# Altium project nixie-thermometer.PrjPcb
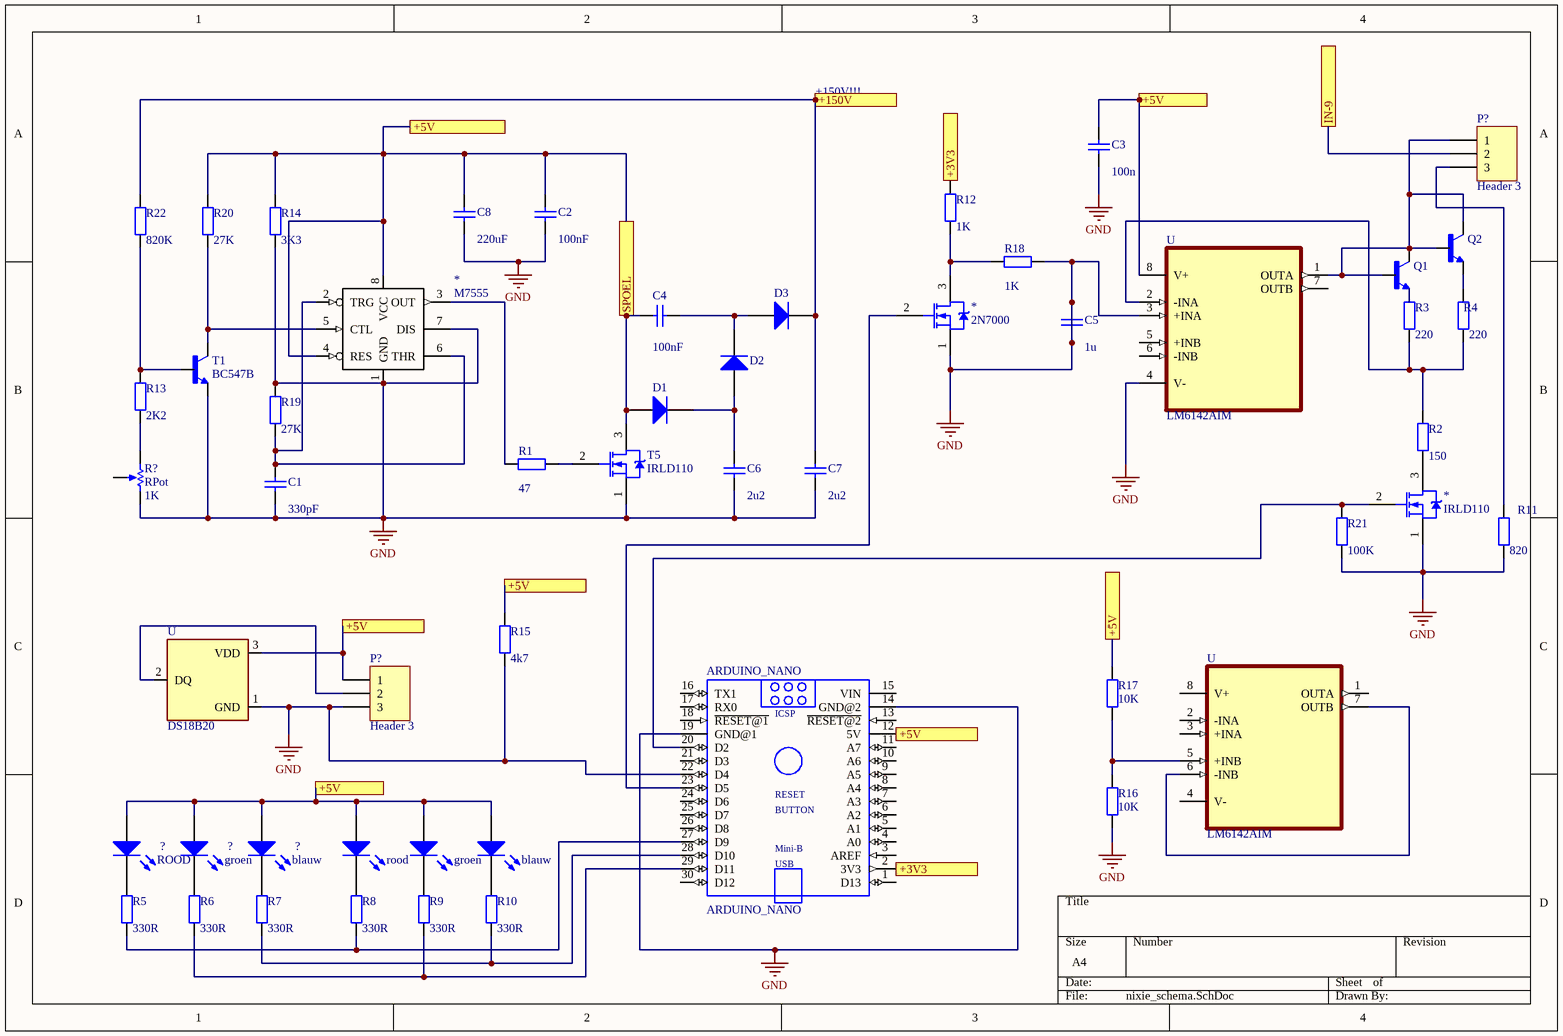
[diagram p0: nixie_schema.SchDoc]
1 sheet, 53 parts. Net scope: flat (ports and power ports of the same name join across sheets).
Board file: nixie_pcb.PcbDoc

## Sheet nixie_schema.SchDoc
size A4

### Parts
(Parts that share a designator on the sheet are numbered #1, #2 ... from top to bottom, then left to right.)
*#1  2N7000
*#2  M7555
*#3  IRLD110
?#1  ROOD  [3.2X1.6X1.1]
?#1  rood  [3.2X1.6X1.1]
?#2  groen  [3.2X1.6X1.1]
?#2  groen  [3.2X1.6X1.1]
?#3  blauw  [3.2X1.6X1.1]
?#3  blauw  [3.2X1.6X1.1]
ARDUINO_NANO  ARDUINO_NANO  [ARDUINO_NANO]
C1  value 330pF  [RAD-0.3]  (hidden comment: Cap)
C2  value 100nF  [RAD-0.3]  (hidden comment: Cap)
C3  value 100n  [RAD-0.3]  (hidden comment: Cap)
C4  value 100nF  [RAD-0.3]  (hidden comment: Cap)
C5  value 1u  [RAD-0.3]  (hidden comment: Cap)
C6  value 2u2  [RAD-0.3]  (hidden comment: Cap)
C7  value 2u2  [RAD-0.3]  (hidden comment: Cap)
C8  value 220uF  [RAD-0.3]  (hidden comment: Cap)
D1  MUR160G  (value not drawn)
D2  MUR160G  (value not drawn)
D3  MUR160G  (value not drawn)
P?#1  Header 3  [HDR1X3]
P?#2  Header 3  [HDR1X3]
Q1  MPSA42  [TO92]  (value not drawn)
Q2  MPSA42  [TO92]  (value not drawn)
R1  value 47  [AXIAL-0.4]  (hidden comment: Res2)
R2  value 150  [AXIAL-0.4]  (hidden comment: Res2)
R3  value 220  [AXIAL-0.4]  (hidden comment: Res2)
R4  value 220  [AXIAL-0.4]  (hidden comment: Res2)
R5  value 330R  [AXIAL-0.4]  (hidden comment: Res2)
R6  value 330R  [AXIAL-0.4]  (hidden comment: Res2)
R7  value 330R  [AXIAL-0.4]  (hidden comment: Res2)
R8  value 330R  [AXIAL-0.4]  (hidden comment: Res2)
R9  value 330R  [AXIAL-0.4]  (hidden comment: Res2)
R10  value 330R  [AXIAL-0.4]  (hidden comment: Res2)
R11  value 820  [AXIAL-0.4]  (hidden comment: Res2)
R12  value 1K  [AXIAL-0.4]  (hidden comment: Res2)
R13  value 2K2  [AXIAL-0.4]  (hidden comment: Res2)
R14  value 3K3  [AXIAL-0.4]  (hidden comment: Res2)
R15  value 4k7  [AXIAL-0.4]  (hidden comment: Res2)
R16  value 10K  [AXIAL-0.4]  (hidden comment: Res2)
R17  value 10K  [AXIAL-0.4]  (hidden comment: Res2)
R18  value 1K  [AXIAL-0.4]  (hidden comment: Res2)
R19  value 27K  [AXIAL-0.4]  (hidden comment: Res2)
R20  value 27K  [AXIAL-0.4]  (hidden comment: Res2)
R21  value 100K  [AXIAL-0.4]  (hidden comment: Res2)
R22  value 820K  [AXIAL-0.4]  (hidden comment: Res2)
R?  RPot  value 1K  [VR5]
T1  BC547B  [TO92]
T5  IRLD110
U#1  LM6142AIM  [SOIC127P600X175-8N]
U#2  DS18B20  [TO-92-TO92127P495H2044-3]
U#3  LM6142AIM  [SOIC127P600X175-8N]

### Ports
+3V3, +5V, +150V, IN-9, SPOEL

### Nets
GND: *#1.1(S) *#2.1(GND) *#2.7(DIS) *#3.1(S) ARDUINO_NANO.14(GND@2) ARDUINO_NANO.19(GND@1) ARDUINO_NANO.22(D4) C1.1 C2.1 C3.2 C5.1 C5.2 C6.2 C7.2 C8.1 P?#2.3 R11.1 R14.1 R15.1 R16.2 R18.1 R19.2 R21.1 R?.2(BOT) T1.3(E) T5.1(S) U#1.3(+INA) U#1.4(V-) U#2.1(GND)
Net*#1_2: *#1.2(G) ARDUINO_NANO.23(D5)
Net*#1_3: *#1.3(D) R12.1 R18.2
Net*#2_2: *#2.2(TRG) *#2.6(THR) C1.2 R19.1
Net*#2_3: *#2.3(OUT) R1.2
Net*#2_4: *#2.4(RES) *#2.8(VCC) ?#1.1(A) ?#2.1(A) ?#3.1(A) ARDUINO_NANO.12(5V) C2.2 C3.1 C4.2 C8.2 D1.2(A) P?#2.1 R14.2 R15.2 R17.1 R20.2 T5.3(D) U#1.8(V+) U#2.3(VDD) ; port SPOEL, port +5V
Net*#2_5: *#2.5(CTL) R20.1 T1.1(C)
Net*#3_2: *#3.2(G) ARDUINO_NANO.20(D2) R21.2
Net*#3_3: *#3.3(D) R2.2
Net?#1_2: ?#1.2(K) R5.2
Net?#1_2: ?#1.2(K) R8.2  [a separate net that carries the same name]
Net?#2_2: ?#2.2(K) R6.2
Net?#2_2: ?#2.2(K) R9.2  [a separate net that carries the same name]
Net?#3_2: ?#3.2(K) R7.2
Net?#3_2: ?#3.2(K) R10.2  [a separate net that carries the same name]
NetARDUINO_NANO_2: ARDUINO_NANO.2(3V3) R12.2 ; port +3V3
NetARDUINO_NANO_27: ARDUINO_NANO.27(D9) R5.1 R8.1
NetARDUINO_NANO_28: ARDUINO_NANO.28(D10) R7.1 R10.1
NetARDUINO_NANO_29: ARDUINO_NANO.29(D11) R6.1 R9.1
NetC4_1: C4.1 D2.1(K) D3.2(A)
NetC6_1: C6.1 D1.1(K) D2.2(A)
NetC7_1: C7.1 D3.1(K) R22.2 ; port +150V
NetP?#1_1: P?#1.1 Q1.1(C) Q1.2(B) Q2.1(C) Q2.2(B) U#1.1(OUTA)
NetP?#1_2: P?#1.2 ; port IN-9
NetP?#1_3: P?#1.3 R11.2
NetP?#2_2: P?#2.2 U#2.2(DQ)
NetQ1_3: Q1.3(E) R3.1
NetQ2_3: Q2.3(E) R4.1
NetR1_1: R1.1 T5.2(G)
NetR2_1: R2.1 R3.2 R4.2 U#1.2(-INA)
NetR13_1: R13.1 R?.1(TOP)
NetR13_2: R13.2 R22.1 T1.2(B)
NetR16_1: R16.1 R17.2 U#3.5(+INB)
NetU#3_6: U#3.6(-INB) U#3.7(OUTB)

Not connected (* = marked no-connect by the designer): ARDUINO_NANO 1(D13) 3(AREF) 4(A0) 5(A1) 6(A2) 7(A3) 8(A4) 9(A5) 10(A6) 11(A7) 13(~{RESET@2}) 15(VIN) 16(TX1) 17(RX0) 18(~{RESET@1}) 21(D3) 24(D6) 25(D7) 26(D8) 30(D12); R? 3(TAP); U#1 5(+INB) 6(-INB) 7(OUTB); U#3 1(OUTA) 2(-INA) 3(+INA) 4(V-) 8(V+)

### Notes on the sheet
- +150V!!!
- (in symbol ARDUINO_NANO) ICSP; RESET; BUTTON; Mini-B; USB

### Library data of the parts
*#1 *#3 T5 = 2N7000: mosfet
*#2 = M7555: IC
?#1 ?#1 ?#2 ?#2 ?#3 ?#3 = LED2: Typical RED, GREEN, YELLOW, AMBER GaAs LED; Published: 8-Jun-2000; LatestRevisionDate: 17-Jul-2002; LatestRevisionNote: Re-released for DXP Platform.; PackageVersion: Feb-2002; PackageReference: 3.2X1.6X1.1; Publisher: Altium Limited; PackageDescription: SM LED; 2 Flat Leads
ARDUINO_NANO = ARDUINO_NANO: ATSAMD21G18A Arduino Nano 33 IoT SAM D ARMÂ® CortexÂ®-M0+ MCU 32-Bit Embedded Evaluation Board; Package: None; Availability: Unavailable; MP: ARDUINO NANO; Value: *; SnapEDA_Link: https://www.snapeda.com/parts/ARDUINO%20NANO/Arduino/view-part/1128261/?ref=snap; Price: None; MF: Arduino
C1-C8 = Cap: Capacitor; Published: 8-Jun-2000; LatestRevisionDate: 17-Jul-2002; LatestRevisionNote: Re-released for DXP Platform.; PackageReference: RAD-0.3; Publisher: Altium Limited; PackageDescription: Radial Cap, Thru-Hole; 2 Leads; 0.3 in Pin Spacing
D1-D3 = MUR160G: Diode
P?#1 P?#2 = Header 3: Header, 3-Pin; LatestRevisionDate: 17-Jul-2002; LatestRevisionNote: Re-released for DXP Platform.; Publisher: Altium Limited
Q1 Q2 T1 = MPSA42: Bipolar _BJT_ Transistor NPN 300V 500mA 50MHz 625mW Through Hole TO-92-3; MF: ON Semiconductor; Package: TO-92 Multicomp; Availability: Unavailable; MP: MPSA42; Value: *; SnapEDA_Link: https://www.snapeda.com/parts/MPSA42/ON%20Semiconductor/view-part/1700309/?ref=snap; Price: None
R1-R22 = Res2: Resistor; Published: 8-Jun-2000; LatestRevisionDate: 17-Jul-2002; LatestRevisionNote: Re-released for DXP Platform.; PackageReference: AXIAL-0.4; Publisher: Altium Limited; PackageDescription: Axial Device, Thru-Hole; 2 Leads; 0.4 in Pin Spacing
R? = RPot: Potentiometer; Sim Note: Enter the Resistance value and the set point into parameter fields.; Set Position: 0.5; Published: 8-Jun-2000; LatestRevisionDate: 17-Jul-2002; LatestRevisionNote: Re-released for DXP Platform.; PackageReference: VR5; Publisher: Altium Limited; PackageDescription: Variable Resistor, Thru-Hole; 3 Leads
U#1 U#3 = LM6142AIM: General Purpose Amplifier 2 Circuit Rail-to-Rail 8-SOIC; MF: Texas Instruments; Package: SOIC-8 Texas Instruments; Availability: Unavailable; MP: LM6142AIM; Value: *; SnapEDA_Link: https://www.snapeda.com/parts/LM6142AIM/Texas%20Instruments/view-part/18000/?ref=snap; Price: None
U#2 = DS18B20: Temperature Sensor Digital, Local -55Â°C ~ 125Â°C 12 b TO-92-3; MF: Maxim Integrated; Package: TO-92 Maxim Integrated; Value: *; Price: None; MP: DS18B20; Availability: Unavailable; SnapEDA_Link: https://www.snapeda.com/parts/DS18B20/Maxim%20Integrated/view-part/1266091/?ref=snap